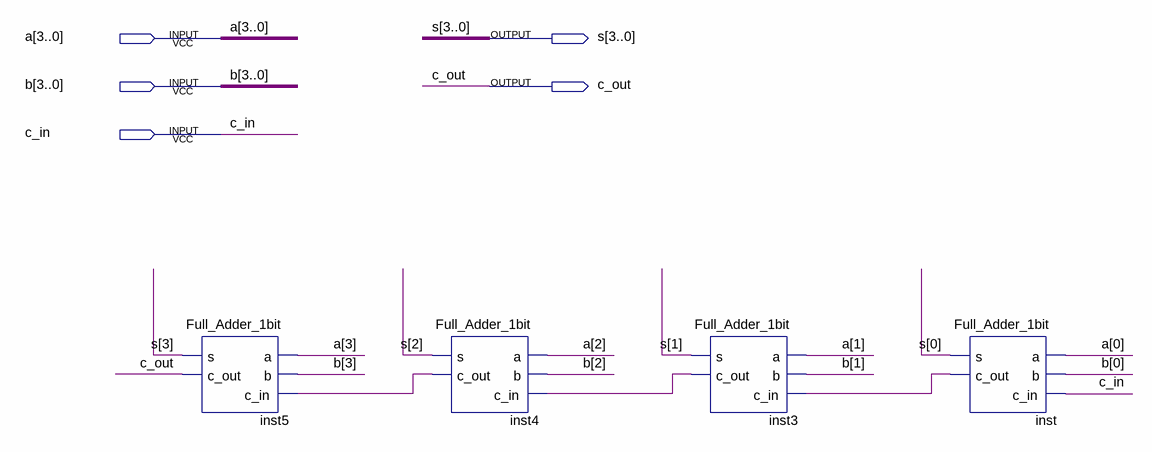
[diagram p0: schematic sheet]
// Quartus schematic Full_Adder_4bit.bdf as structural Verilog: 4 symbols, 5 pins
module Full_Adder_4bit (
  input  [3:0] a,
  input  [3:0] b,
  input  c_in,
  output [3:0] s,
  output c_out
);

  wire inst3_c_out, inst4_c_out, inst_c_out;

  Full_Adder_1bit inst5 (.a(a[3]), .b(b[3]), .c_in(inst4_c_out), .s(s[3]), .c_out(c_out));
  Full_Adder_1bit inst4 (.a(a[2]), .b(b[2]), .c_in(inst3_c_out), .s(s[2]), .c_out(inst4_c_out));
  Full_Adder_1bit inst3 (.a(a[1]), .b(b[1]), .c_in(inst_c_out), .s(s[1]), .c_out(inst3_c_out));
  Full_Adder_1bit inst (.a(a[0]), .b(b[0]), .c_in(c_in), .s(s[0]), .c_out(inst_c_out));
endmodule
